# Altium schematic sheet uAMDC.SchDoc: uAMDC
size 279 x 215 mm; Engineer: Prasoon Sinha; DocumentNumber: 1; SheetNumber: 1; SheetTotal: 26
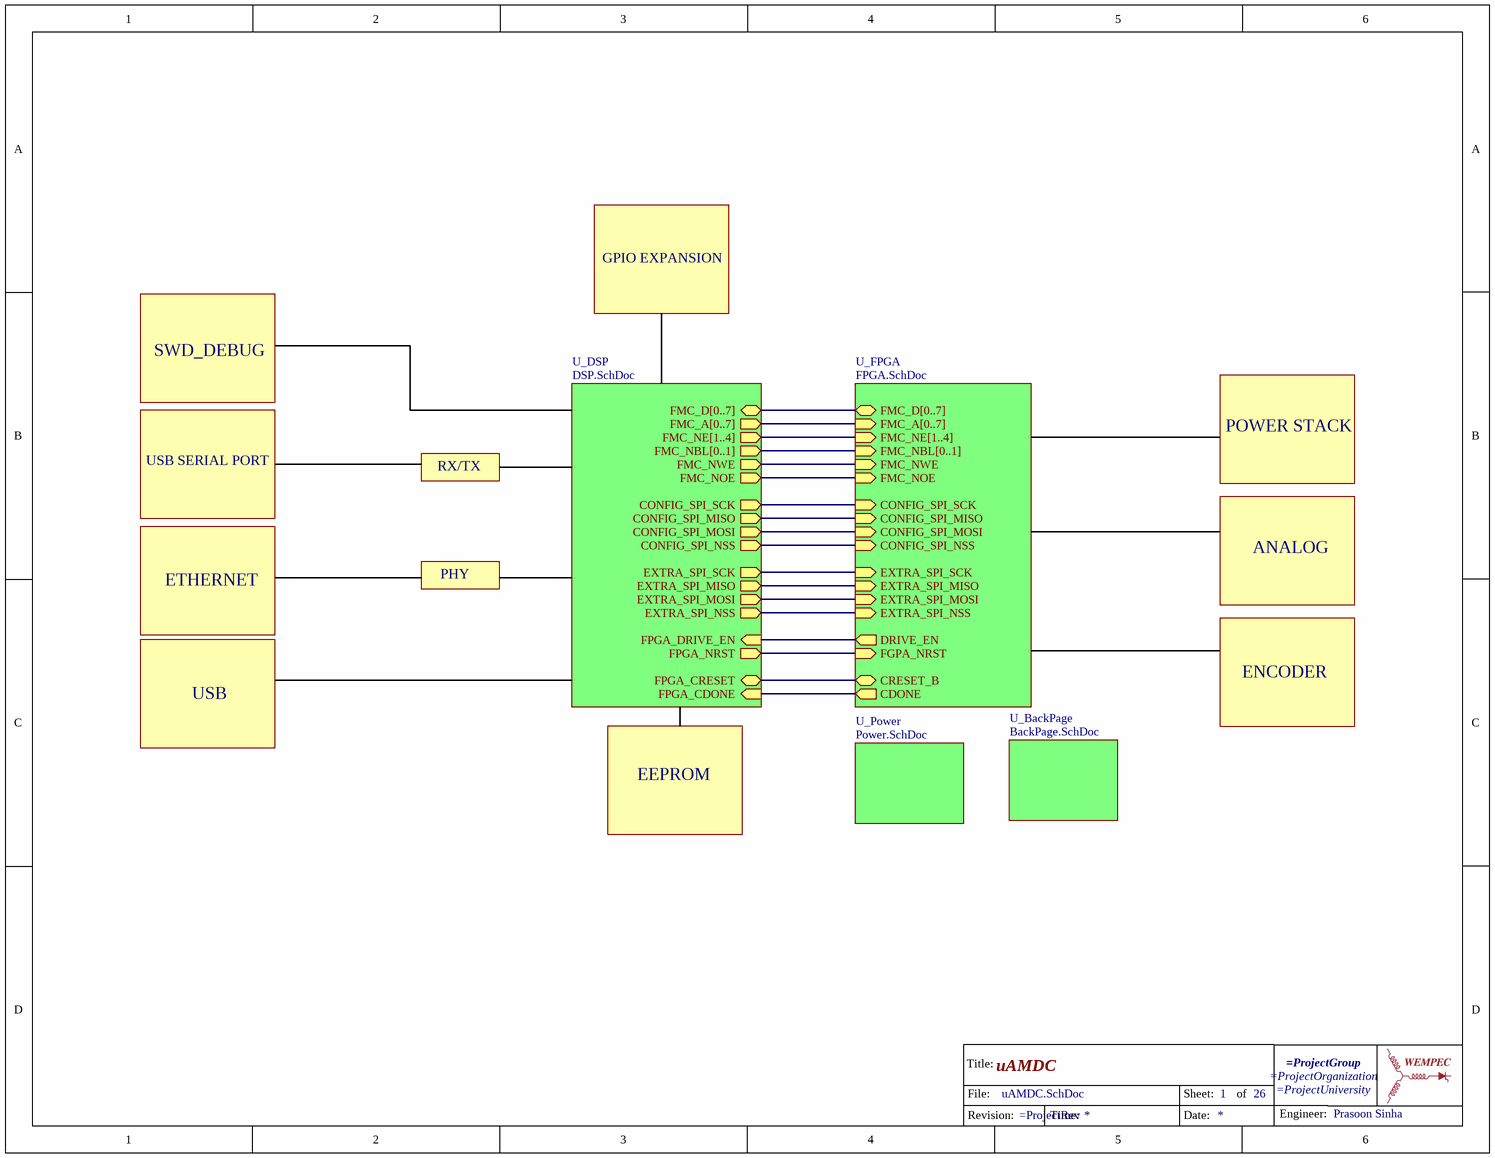
[diagram p0: uAMDC.SchDoc]

## Parts
*?  TitleBlockWEMPEC  (value not drawn)  (graphical)

## Sub-sheets
U_BackPage = BackPage.SchDoc: no entries
U_DSP = DSP.SchDoc: FMC_A[0..7] (out), FMC_NBL[0..1] (out), FMC_D[0..7] (bidir), FMC_NWE (out), FMC_NOE (out), FMC_NE[1..4] (out), FPGA_DRIVE_EN (in), FPGA_CDONE (in), FPGA_NRST (out), EXTRA_SPI_SCK (out), CONFIG_SPI_MISO (out), CONFIG_SPI_MOSI (out), EXTRA_SPI_NSS (out), FPGA_CRESET (bidir), CONFIG_SPI_SCK (out), CONFIG_SPI_NSS (out), EXTRA_SPI_MOSI (out), EXTRA_SPI_MISO (out)
U_FPGA = FPGA.SchDoc: FMC_NWE (in), FMC_NE[1..4] (in), FMC_NBL[0..1] (in), FMC_A[0..7] (in), FMC_D[0..7] (bidir), FMC_NOE (in), CDONE (out), DRIVE_EN (out), FGPA_NRST (in), CONFIG_SPI_SCK (in), CONFIG_SPI_MOSI (in), CRESET_B (bidir), EXTRA_SPI_SCK (in), CONFIG_SPI_NSS (in), EXTRA_SPI_MISO (in), EXTRA_SPI_MOSI (in), EXTRA_SPI_NSS (in), CONFIG_SPI_MISO (in)
U_Power = Power.SchDoc: no entries

## Nets
(unnamed): sheet U_DSP/FMC_NWE, sheet U_FPGA/FMC_NWE
(unnamed): sheet U_DSP/FMC_NOE, sheet U_FPGA/FMC_NOE
(unnamed): sheet U_DSP/FPGA_DRIVE_EN, sheet U_FPGA/DRIVE_EN
(unnamed): sheet U_DSP/FPGA_CDONE, sheet U_FPGA/CDONE
(unnamed): sheet U_DSP/FPGA_NRST, sheet U_FPGA/FGPA_NRST
(unnamed): sheet U_DSP/EXTRA_SPI_SCK, sheet U_FPGA/EXTRA_SPI_SCK
(unnamed): sheet U_DSP/CONFIG_SPI_MISO, sheet U_FPGA/CONFIG_SPI_MISO
(unnamed): sheet U_DSP/CONFIG_SPI_MOSI, sheet U_FPGA/CONFIG_SPI_MOSI
(unnamed): sheet U_DSP/EXTRA_SPI_NSS, sheet U_FPGA/EXTRA_SPI_NSS
(unnamed): sheet U_DSP/FPGA_CRESET, sheet U_FPGA/CRESET_B
(unnamed): sheet U_DSP/CONFIG_SPI_SCK, sheet U_FPGA/CONFIG_SPI_SCK
(unnamed): sheet U_DSP/CONFIG_SPI_NSS, sheet U_FPGA/CONFIG_SPI_NSS
(unnamed): sheet U_DSP/EXTRA_SPI_MOSI, sheet U_FPGA/EXTRA_SPI_MOSI
(unnamed): sheet U_DSP/EXTRA_SPI_MISO, sheet U_FPGA/EXTRA_SPI_MISO

## Buses and harness runs
bus sheet U_DSP/FMC_A[0..7] = sheet U_FPGA/FMC_A[0..7]
bus sheet U_DSP/FMC_D[0..7] = sheet U_FPGA/FMC_D[0..7]
bus sheet U_DSP/FMC_NBL[0..1] = sheet U_FPGA/FMC_NBL[0..1]
bus sheet U_DSP/FMC_NE[1..4] = sheet U_FPGA/FMC_NE[1..4]

## Notes on the sheet
- GPIO EXPANSION
- SWD_DEBUG
- POWER STACK
- USB SERIAL PORT
- RX/TX
- ANALOG
- ETHERNET
- PHY
- USB
- ENCODER
- EEPROM
- (in symbol TitleBlockWEMPEC) Title:; File:; Sheet:; of; Engineer:; Revision:; Time:; Date: